# EAGLE design e_sensor (EAGLE 9.6.2)
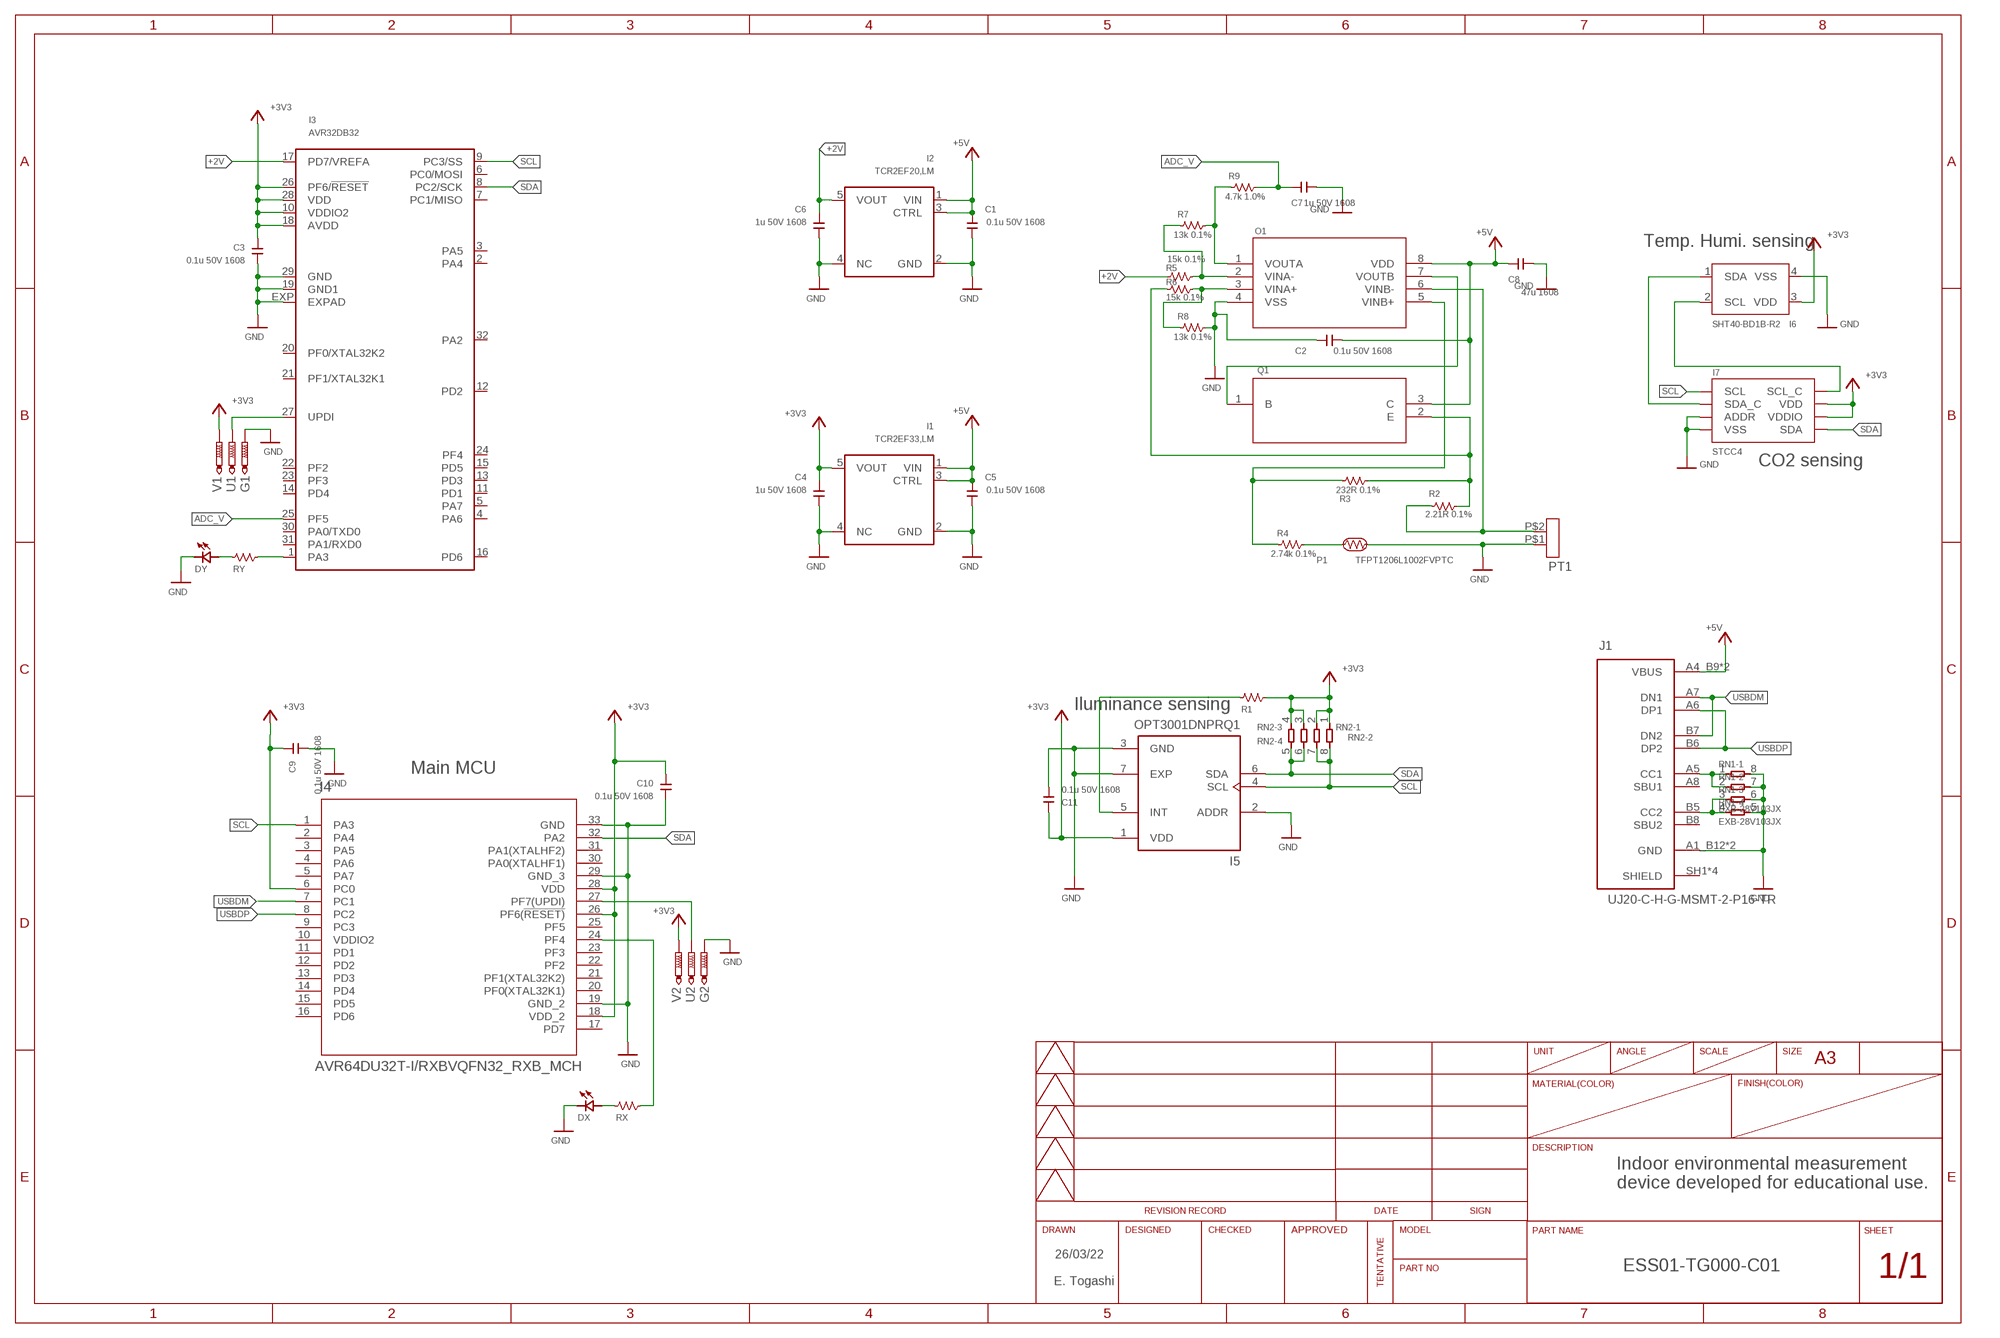
[diagram p0: schematic, sheet 1]

## Parts
C1  0.1u 50V 1608  CL10A105KP8NNNC  [C-1608/0603]
C2  0.1u 50V 1608  CL10A105KP8NNNC  [C-1608/0603]
C3  0.1u 50V 1608  CL10A105KP8NNNC  [C-1608/0603]
C4  1u 50V 1608  CL10A105KP8NNNC  [C-1608/0603]
C5  0.1u 50V 1608  CL10A105KP8NNNC  [C-1608/0603]
C6  1u 50V 1608  CL10A105KP8NNNC  [C-1608/0603]
C7  1u 50V 1608  CL10A105KP8NNNC  [C-1608/0603]
C8  47u 1608  CL10A105KP8NNNC  [C-1608/0603]
C9  0.1u 50V 1608  CL10A105KP8NNNC  [C-1608/0603]
C10  0.1u 50V 1608  CL10A105KP8NNNC  [C-1608/0603]
C11  0.1u 50V 1608  CL10A105KP8NNNC  [C-1608/0603]
DX  SML-D12D1WT86  [SMD-1608]
DY  SML-D12D1WT86  [SMD-1608]
G1  PTR1B1,27  [B1,27]
G2  PTR1B1,27  [B1,27]
I1  TCR2EF33,LM  TCR2EF20,LM  [SOT23-5L]
I2  TCR2EF20,LM  [SOT23-5L]
I3  AVR32DB32  [HVQFN32]
I4  AVR64DU32T-I/RXBVQFN32_RXB_MCH  [VQFN32_RXB_MCH]
I5  OPT3001DNPRQ1  [SON65P200X200X65-7N]
I6  SHT40-BD1B-R2  SHT41  [SHT41]
I7  STCC4  [STCC4]
J1  UJ20-C-H-G-MSMT-2-P16-TR  [SAMESKY_UJ20-C-H-G-MSMT-2-P16-TR]
O1  MCP6V02T-E/MDDFN8_4X4MC_MCH  [DFN8_4X4MC_MCH]
P1  TFPT1206L1002FVPTC  [C1206]
PT1  VELHOLE  [VELHOLE]
Q1  MMBT3904-7-FSOT-23_1_DIO  [SOT-23_1_DIO]
R1  510R 1608  R-1608  [R-1608/0603]
R2  2.21R 0.1%  R-1608  [R-1608/0603]
R3  232R 0.1%  R-1608  [R-1608/0603]
R4  2.74k 0.1%  R-1608  [R-1608/0603]
R5  15k 0.1%  R-1608  [R-1608/0603]
R6  15k 0.1%  R-1608  [R-1608/0603]
R7  13k 0.1%  R-1608  [R-1608/0603]
R8  13k 0.1%  R-1608  [R-1608/0603]
R9  4.7k 1.0%  R-1608  [R-1608/0603]
RN1  EXB-28V103JX  [RESCAXS50P200X100X45-8N]
RN2  EXB-28V103JX  [RESCAXS50P200X100X45-8N]
RX  510R 1608  R-1608  [R-1608/0603]
RY  510R 1608  R-1608  [R-1608/0603]
U1  PTR1B1,27  [B1,27]
U2  PTR1B1,27  [B1,27]
V1  PTR1B1,27  [B1,27]
V2  PTR1B1,27  [B1,27]

## Nets
+2V [PWR]: C6.P$1 I2.5(VOUT) I3.17(PD7/VREFA) R5.1
+3V3: C3.P$1 C4.P$1 C9.P$1 C10.P$1 C11.P$1 I1.5(VOUT) I3.10(VDDIO2) I3.18(AVDD) I3.26(PF6/!RESET) I3.28(VDD) I4.6(PC0) I4.18(VDD_2) I4.26(PF6(!RESET)) I4.28(VDD) I5.1(VDD) I6.3(VDD) I7.VDD I7.VDDIO R1.2 RN2.1 RN2.2 RN2.3 RN2.4 V1.TP V2.TP
+5V: C1.P$1 C2.P$1 C5.P$1 C8.P$1 I1.1(VIN) I1.3(CTRL) I2.1(VIN) I2.3(CTRL) J1.A4_B9(VBUS) J1.B4_A9(VBUS) O1.8(VDD) Q1.3(C)
ADC_V: C7.P$1 I3.25(PF5) R9.2
GND: C1.P$2 C2.P$2 C3.P$2 C4.P$2 C5.P$2 C6.P$2 C7.P$2 C8.P$2 C9.P$2 C10.P$2 C11.P$2 DX.2(C) DY.2(C) G1.TP G2.TP I1.2(GND) I1.4(NC) I2.2(GND) I2.4(NC) I3.19(GND1) I3.29(GND) I3.EXP(EXPAD) I4.19(GND_2) I4.29(GND_3) I4.33(GND) I5.2(ADDR) I5.3(GND) I5.7(EXP) I6.4(VSS) I7.ADDR I7.VSS J1.A1_B12(GND) J1.B1_A12(GND) O1.4(VSS) P1.1 PT1.P$1 R8.2 RN1.5 RN1.6 RN1.7 RN1.8
N$1: I4.24(PF4) RX.2
N$2: DY.1(A) RY.1
N$3: O1.1(VOUTA) R7.2 R9.1
N$4: DX.1(A) RX.1
N$5: O1.5(VINB+) R3.1 R4.1
N$6: I3.1(PA3) RY.2
N$7: J1.A5(CC1) RN1.1 RN1.2
N$8: J1.B5(CC2) RN1.3 RN1.4
N$9: I5.5(INT) R1.1
N$38: Q1.2(E) R2.2 R3.2 R6.1
N$42: O1.7(VOUTB) Q1.1(B)
N$44: O1.3(VINA+) R6.2 R8.1
N$46: O1.2(VINA-) R5.2 R7.1
PT1: O1.6(VINB-) PT1.P$2 R2.1
PTC1: P1.2 R4.2
SCL: I3.9(PC3/SS) I4.1(PA3) I5.4(SCL) I7.SCL RN2.7 RN2.8
SCL_C: I6.2(SCL) I7.SCL_C
SDA: I3.8(PC2/SCK) I4.32(PA2) I5.6(SDA) I7.SDA RN2.5 RN2.6
SDA_C: I6.1(SDA) I7.SDA_C
UPDI1: I3.27(UPDI) U1.TP
UPDI2: I4.27(PF7(UPDI)) U2.TP
USBDM: I4.7(PC1) J1.A7(DN1) J1.B7(DN2)
USBDP: I4.8(PC2) J1.A6(DP1) J1.B6(DP2)
Unconnected: I3.2(PA4) I3.3(PA5) I3.4(PA6) I3.5(PA7) I3.6(PC0/MOSI) I3.7(PC1/MISO) I3.11(PD1) I3.12(PD2) I3.13(PD3) I3.14(PD4) I3.15(PD5) I3.16(PD6) I3.20(PF0/XTAL32K2) I3.21(PF1/XTAL32K1) I3.22(PF2) I3.23(PF3) I3.24(PF4) I3.30(PA0/TXD0) I3.31(PA1/RXD0) I3.32(PA2) I4.2(PA4) I4.3(PA5) I4.4(PA6) I4.5(PA7) I4.9(PC3) I4.11(PD1) I4.12(PD2) I4.13(PD3) I4.14(PD4) I4.15(PD5) I4.16(PD6) I4.17(PD7) I4.20(PF0(XTAL32K1)) I4.21(PF1(XTAL32K2)) I4.22(PF2) I4.23(PF3) I4.25(PF5) I4.30(PA0(XTALHF1)) I4.31(PA1(XTALHF2)) J1.A8(SBU1) J1.B8(SBU2) J1.SH1(SHIELD) J1.SH2(SHIELD) J1.SH3(SHIELD) J1.SH4(SHIELD)

## Notes on the sheet
- Temp. Humi. sensing
- CO2 sensing
- Iluminance sensing
- Main MCU
- Indoor environmental measurement
  device developed for educational use.
- 26/03/22
- ESS01-TG000-C01
- E. Togashi

## Power pins joined to a net without a drawn wire
VDDIO2: I4.10(VDDIO2)

## Library data of the parts
C1-C11 = yamaguchi:CL10A105KP8NNNC
DX DY = yamaguchi:SML-D12D1WT86
G1 G2 U1 U2 V1 V2 = testpad:PTR1: TEST PIN
I1 I2 = yamaguchi:TCR2EF20,LM
I3 = yamaguchi:AVR32DB32
I4 = AVR64DU32T-I-RXB:AVR64DU32T-I/RXB; COPYRIGHT: Copyright (C) 2025 Ultra Librarian. All rights reserved.; MANUFACTURER_NAME: Microchip; MANUFACTURER_PART_NUMBER: AVR64DU32T-I/RXB; TYPE: Embedded
I5 = OPT3001DNPRQ1:OPT3001DNPRQ1; A_MAX: 0.65; B_MAX: 0.3; B_MIN: 0.2; B_NOM: 0.25; D2_NOM: 1.35; D_MAX: 2.1; D_MIN: 1.9; D_NOM: 2.0; E2_NOM: 0.65; ENOM: 0.65; E_MAX: 2.1; E_MIN: 1.9; E_NOM: 2.0; L_MAX: 0.35; L_MIN: 0.25; L_NOM: 0.3; MANUFACTURER: Texas Instruments; PARTREV: 01/2018; PIN_COUNT: 6.0; STANDARD: IPC 7351B
I6 = yamaguchi:SHT41
I7 = yamaguchi:STCC4
J1 = UJ20-C-H-G-MSMT-2-P16-TR:UJ20-C-H-G-MSMT-2-P16-TR; MANUFACTURER: Same Sky; MAXIMUM_PACKAGE_HEIGHT: 3.36mm; PARTREV: 1.0; STANDARD: Manufacturer Recommendations
O1 = MCP6V02:MCP6V02T-E/MD; COPYRIGHT: Copyright (C) 2025 Ultra Librarian. All rights reserved.; MANUFACTURER_NAME: Microchip; MANUFACTURER_PART_NUMBER: MCP6V02T-E/MD
P1 = yamaguchi:TFPT1206L1002FV
PT1 = velhole:VELHOLE
Q1 = MMBT3904:MMBT3904-7-F; COPYRIGHT: Copyright (C) 2025 Ultra Librarian. All rights reserved.; MANUFACTURER_NAME: Diodes Inc; MANUFACTURER_PART_NUMBER: MMBT3904-7-F
R1-R9 RX RY = yamaguchi:R-1608: R 1608/0603
RN1 RN2 = yamaguchi:EXB-28V103JX

## Net classes
0 default: width 0.127 mm
1 GND: width 0.127 mm
2 PWR: width 0.127 mm

## Board
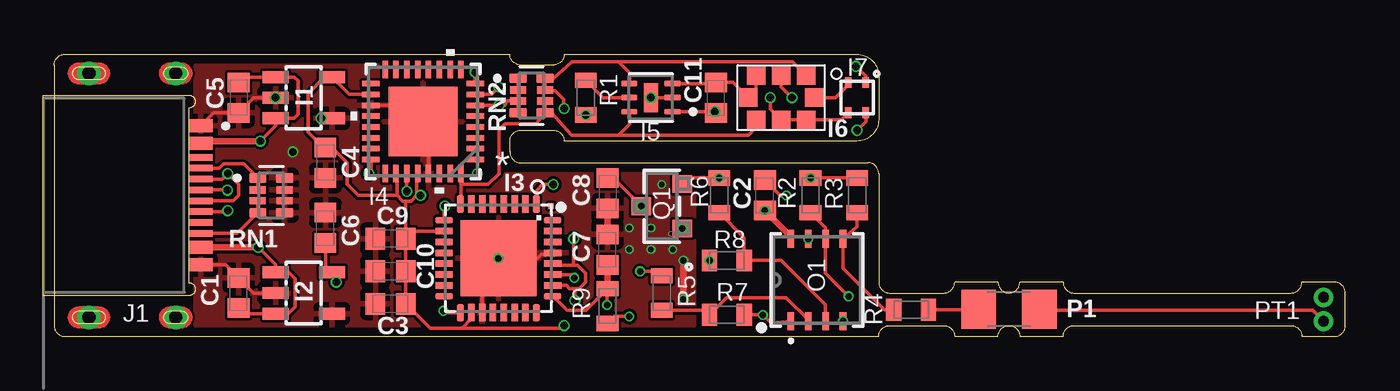
[diagram p1: board, top side]
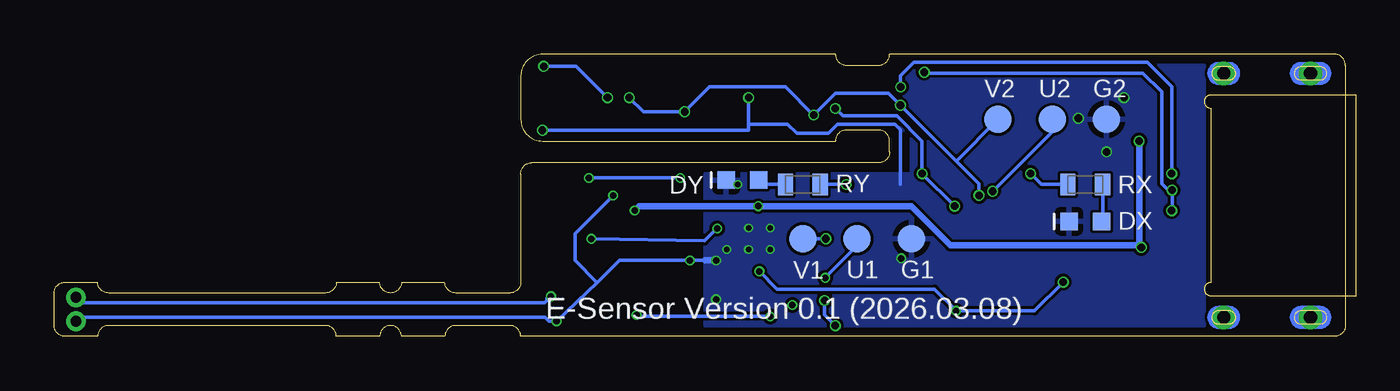
[diagram p2: board, bottom side, seen from below]

Size 59.5 x 13 mm. Coordinates in mm from the lower left corner, seen from the top.
Outline: 0,12.5 0,0.5 arc90 0.5,0 38,0 arc-90 38.5,0.5 41,0.5 arc-90 41.5,0 43.5,0 arc-90 44,0.5 arc-90 44.5,0 46.5,0 arc-90 47,0.5 57,0.5 arc-90 57.5,0 59,0 arc90 59.5,0.5 59.5,2 arc90 59,2.5 57.5,2.5 arc-90 57,2 47,2 arc-90 46.5,2.5 44.5,2.5 arc-90 44,2 arc-90 43.5,2.5 41.5,2.5 arc-90 41,2 38.5,2 arc-90 38,2.5 38,7.5 arc90 37.5,8 21.5,8 arc-90 21,8.5 21,9 arc-90 21.5,9.5 23,9.5 arc-90 23.5,9 37,9 arc90 38,10 38,12 arc90 37,13 23.5,13 arc-90 23,12.5 21.5,12.5 arc-90 21,13 0.5,13 arc90 0,12.5
Copper layers (1*16): Top 0.035mm / dielectric 1.6mm / Bottom 0.035mm
Design rules "jlcpcb-2layers *": minimum track width 5mil, minimum drill 0.3mm, track to track 5mil, track to pad 5mil, pad to pad 5mil, via to via 5mil, smd to smd 5mil, copper to edge 0.2mm, drill to drill 6mil, minimum pad ring 5mil, minimum via ring 3mil, stop-mask expansion 4mil, vias tented up to drill 20mil, thermal gap 10mil

### Footprints (pad centres in the part's own frame; a part is rotated, then mirrored left to right if it is on the bottom)
C-1608/0603 = smd 0.9 x 1: P$1 -0.7,0; P$2 0.7,0
SMD-1608 = smd 0.8 x 0.8: 1 -0.75,0; 2 0.75,0
B1,27 = smd 1.27 x 1.27: TP 0,0
SOT23-5L = smd 0.55 x 1.2: 1 -0.95,-1.3; 2 0,-1.3; 3 0.95,-1.3; 4 0.95,1.3; 5 -0.95,1.3
HVQFN32 = smd 0.8 x 0.3: 1 -2.5,1.75; 2 -2.5,1.25; 3 -2.5,0.75; 4 -2.5,0.25; 5 -2.5,-0.25; 6 -2.5,-0.75; 7 -2.5,-1.25; 8 -2.5,-1.75; 17 2.5,-1.75; 18 2.5,-1.25; 19 2.5,-0.75; 20 2.5,-0.25; 21 2.5,0.25; 22 2.5,0.75; 23 2.5,1.25; 24 2.5,1.75 | smd 0.3 x 0.8: 9 -1.75,-2.5; 10 -1.25,-2.5; 11 -0.75,-2.5; 12 -0.25,-2.5; 13 0.25,-2.5; 14 0.75,-2.5; 15 1.25,-2.5; 16 1.75,-2.5; 25 1.75,2.5; 26 1.25,2.5; 27 0.75,2.5; 28 0.25,2.5; 29 -0.25,2.5; 30 -0.75,2.5; 31 -1.25,2.5; 32 -1.75,2.5 | smd 3.5 x 3.5: EXP 0,0 | smd 0.25 x 0.25: M1 -2.415,2.415
VQFN32_RXB_MCH = smd 0.813 x 0.254: 1 -2.4,1.75; 2 -2.4,1.25; 3 -2.4,0.75; 4 -2.4,0.25; 5 -2.4,-0.25; 6 -2.4,-0.75; 7 -2.4,-1.25; 8 -2.4,-1.75; 17 2.4,-1.75; 18 2.4,-1.25; 19 2.4,-0.75; 20 2.4,-0.25; 21 2.4,0.25; 22 2.4,0.75; 23 2.4,1.25; 24 2.4,1.75 | smd 0.254 x 0.813: 9 -1.75,-2.4; 10 -1.25,-2.4; 11 -0.75,-2.4; 12 -0.25,-2.4; 13 0.25,-2.4; 14 0.75,-2.4; 15 1.25,-2.4; 16 1.75,-2.4; 25 1.75,2.4; 26 1.25,2.4; 27 0.75,2.4; 28 0.25,2.4; 29 -0.25,2.4; 30 -0.75,2.4; 31 -1.25,2.4; 32 -1.75,2.4 | smd 3.2 x 3.2: 33 0,0
SON65P200X200X65-7N = smd 0.74 x 0.27: 1 -0.995,0.65; 2 -0.995,0; 3 -0.995,-0.65; 4 0.995,-0.65; 5 0.995,0; 6 0.995,0.65 | smd 0.65 x 1.35: 7 0,0
SHT41 = smd 0.5 x 0.3: 1 -0.7,0.4; 2 -0.7,-0.4; 3 0.7,-0.4; 4 0.7,0.4
STCC4 = smd 0.85 x 0.85: ADDR -1.025,-1.15; SCL -1.025,1.15; SCL_C 0,1.525; SDA 1.025,-1.15; SDA_C -1.025,0; VDD 1.025,1.15; VDDIO 1.025,0; VSS 0,-1.525
SAMESKY_UJ20-C-H-G-MSMT-2-P16-TR = smd 0.6 x 1.1: A1_B12 -3.2,7.25; A4_B9 -2.4,7.25; B1_A12 3.2,7.25; B4_A9 2.4,7.25 | smd 0.3 x 1.1: A5 -1.25,7.25; A6 -0.25,7.25; A7 0.25,7.25; A8 1.25,7.25; B5 1.75,7.25; B6 0.75,7.25; B7 -0.75,7.25; B8 -1.75,7.25 | drill 0.6 pad 1: SH1 -5.62,6.1; SH2 5.62,6.1; SH3 -5.62,2.1; SH4 5.62,2.1
DFN8_4X4MC_MCH = smd 0.813 x 0.305: 1 -1.898,1.2; 2 -1.898,0.4; 3 -1.898,-0.4; 4 -1.898,-1.2; 5 1.898,-1.2; 6 1.898,-0.4; 7 1.898,0.4; 8 1.898,1.2
C1206 = smd 1.6 x 1.8: 1 -1.4,0; 2 1.4,0
VELHOLE = drill 0.5 pad 0.8: P$1 -0.55,0; P$2 0.55,0
SOT-23_1_DIO = smd 0.813 x 0.889: 1 -1.025,-0.945; 2 1.025,-0.945; 3 0,0.945
R-1608/0603 = smd 0.7 x 1: 1 -0.8,0; 2 0.8,0
RESCAXS50P200X100X45-8N = smd 0.79 x 0.44: 1 -0.62,0.8; 4 -0.62,-0.8; 5 0.62,-0.8; 8 0.62,0.8 | smd 0.79 x 0.34: 2 -0.62,0.25; 3 -0.62,-0.25; 6 0.62,-0.25; 7 0.62,0.25

### Placement (x,y rotation side)
C1  8.5,2 90 top
C2  32.75,6.5 90 top
C3  15.5,1.5 180 top
C4  12.5,8 270 top
C5  8.5,11 270 top
C6  12.5,5 90 top
C7  25.5,4 90 top
C8  25.5,6.6 270 top
C9  15.5,4.5 180 top
C10  15.5,3 180 top
C11  30.5,11 90 top
DX  11.98,5.3 180 bottom
DY  27.78,7.2 180 bottom
G1  20,4.5 0 bottom
G2  11,10 0 bottom
I1  11.5,11 270 top
I2  11.5,2 270 top
I3  20.47,3.6 270 top
I4  17,9.9 180 top
I5  27.5,11 180 top
I6  37,11 270 top
I7  33.5,11 270 top
J1  -0.5,6.5 270 top
O1  35.15,2.6 90 top
P1  44,1.25 180 top
PT1  58.5,1.25 90 top
Q1  28,6 90 top
R1  24.5,11 270 top
R2  34.86,6.5 90 top
R3  37,6.5 90 top
R4  39.49,1.23 0 top
R5  28,2 270 top
R6  30.65,6.5 270 top
R7  31,1 0 top
R8  31,3.5 180 top
R9  25.5,1.4 90 top
RN1  10,6.5 0 top
RN2  22,11.1 0 top
RX  11.98,7 180 bottom
RY  25,7 0 bottom
U1  22.5,4.5 0 bottom
U2  13.5,10 0 bottom
V1  25,4.5 0 bottom
V2  16,10 0 bottom

### Tracks (layer width: path | path; a pad name or v marks a point on that pad's centre or on a via)
+2V  (via drill 0.3, 0.35)
  Top 0.152: v17.93,1.18 17.93,1.1 I3.17 | v27,3 27.8,3 R5.1 | C6.P$1 12.5,3.25 I2.5 13,2.75 v13,2.5
  Bottom 0.152: v27,3 26.18,2.18 18.93,2.18 v17.93,1.18 14.32,1.18 v13,2.5
+3V3  (via drill 0.35)
  Top 0.152: I3.26 23.6,2.35 23.76,2.19 24,2.19 | I3.28 23.04,3.28 23.94,3.28 | 23.94,3.28 24.11,3.28 24.48,2.91 24.48,2.49 24.18,2.19 24,2.19 | I6.3 36.27,9.97 I7.VDD I7.VDDIO 33,10.47 v33,11 | I5.1 v30.45,10.35 C11.P$1 | RN2.1 RN2.2 RN2.3 | RN2.3 RN2.4 | I4.6 v20.5,10.65 20.78,10.65 20.88,10.85 RN2.3 | I4.18 13.6,11.15 I1.5 12.45,11.95 11.69,11.19 11.69,9.41 12.4,8.7 C4.P$1 12.7,8.5 13,8.5 13.5,8 13.5,7 14,6.5 15.8,6.5 | C9.P$1 C10.P$1 C3.P$1 17.31,0.39 18.8,0.39 | C9.P$1 16.55,4.85 I3.10 | I3.18 19.22,0.81 18.8,0.39 | 16.7,6.5 16.44,6.24 16.19,6.24 | 16.19,6.24 16.06,6.24 15.8,6.5 | I4.28 16.7,7.45 16.7,6.5 | I4.26 15.8,7.45 15.8,6.5 | C9.P$1 16.2,6.23 16.19,6.24 | 16.7,6.5 v16.88,6.5 | 23.94,3.28 v23.94,4.5 | 18.8,0.39 23.39,0.39 v23.5,0.5 | v24,1.65 24,2.19
  Bottom 0.152: v16.88,6.5 16.88,7.03 17.93,8.07 | 17.93,8.07 v20.5,10.65 21.05,11.2 23.5,11.2 R1.2 25.8,11.5 29.3,11.5 v30.45,10.35 32.35,10.35 v33,11 | v23.94,4.5 V1.TP | V2.TP 17.93,8.07 | v23.5,0.5 24,1 v24,1.65
  other vias: 24.5,10.2
+5V  (via drill 0.3, 0.35)
  Top 0.152: 33.95,4.6 O1.8 | C5.P$1 8.75,11.95 I1.1 11.05,11.95 11.23,11.77 11.23,10.23 11.05,10.05 I1.3 10.2,9.7 v9.5,9 | J1.A4_B9 6.85,9 | C1.P$1 8.75,1.05 I2.3 10.78,1.05 11.1,1.37 11.1,2.66 10.81,2.95 I2.1 10.2,3.3 v9.4,4.1 | 25.75,7.3 Q1.3
  Top 0.305: C2.P$1 33.95,4.6 | C8.P$1 25.75,7.3 | 6.85,9 v9.5,9 | J1.B4_A9 v9.4,4.1
  Bottom 0.305: C2.P$1 32.55,6 Q1.3 20,6 18.2,4.2 9.5,4.2 | v9.5,9 9.5,4.2 | 9.5,4.2 v9.4,4.1
  other vias: 27.05,6 32.75,5.8
ADC_V  (via drill 0.3)
  Top 0.152: v25.48,1.45 25.48,2.18 R9.2 24.5,1.2 23.63,1.2 23.1,1.73 23.09,1.73 I3.25
  Top 0.305: C7.P$1 R9.2
GND  (via drill 0.25, 0.3, 0.35)
  Top 0.152: C2.P$2 33.46,6.49 v33.74,6.49 | I3.19 19.72,2.85 I3.EXP 22.27,3.6 22.45,3.78 22.9,3.78 I3.29 | PT1.P$1 58,1.2 45.45,1.2 P1.1 | I5.7 I5.2 I5.3 30.45,11.65 C11.P$2 31.27,11.7 I7.VSS 32.35,11.38 I7.ADDR | I6.4 37.4,9.9 v37,9.5 | J1.A1_B12 7.35,10.3 C5.P$2 9.2,11 I1.2 | J1.B1_A12 7.9,3.3 C1.P$2 9.2,2 I2.2 | I4.19 16.25,10.65 I4.33 17.25,9.65 I4.29 | I1.4 v12.3,10.05
  Top 0.305: v29,3.5 v29,1.71 | C8.P$2 C7.P$2
  Bottom 0.152: 29.5,3.5 R8.2 33.45,3.5 34.48,2.48 | 34.48,2.48 O1.4 36.7,0.7 36.88,0.88 58.32,0.88 PT1.P$1 | v33.74,6.49 35.5,4.73 35.5,3.5 34.48,2.48 | v37,9.5 27.5,9.5 27.5,9.78 | 27.5,9.78 25.7,9.78 25.27,9.35 23.83,9.35 23.4,9.78 20.75,9.78 20.5,9.53 20.5,7 | I5.7 27.5,9.78
  Bottom 0.305: 29.5,3.5 v29,3.5
  other vias: 30.2,3.5 36.35,0.7 20.47,3.6 28,7 27.5,5 26.5,5 26.5,4 27.5,4 28.5,4 27.5,11 10.2,11 11,8.5
  pour Bottom: 6.5,12.5 20.5,12.5 20.5,9.5 20,9.5 20,7.5 29.5,7.5 29.5,0.5 6.5,0.5
  pour Top: 6.5,12.5 20.5,12.5 20.5,9.5 20,9.5 20,7.5 29.5,7.5 29.5,0.5 6.5,0.5
N$1  (via drill 0.35)
  Top 0.152: I4.24 14.6,7.6 v14.5,7.5
  Bottom 0.152: v14.5,7.5 14,7 RX.2
N$2
  Bottom 0.152: DY.1 26.83,7 RY.1
N$3  (via drill 0.3)
  Top 0.152: v26.5,0.92 25.82,0.92 R9.1 | R7.2 v32.66,0.99 33.05,0.6 O1.1
  Bottom 0.152: v26.5,0.92 32.59,0.92 v32.66,0.99
N$4
  Bottom 0.152: RX.1 11.18,5.35 DX.1
N$5
  Top 0.152: R3.1 37,5.05 O1.5 36.35,3.15 38.27,1.23 R4.1
N$6  (via drill 0.35)
  Top 0.152: I3.1 22.22,6.72 22.5,7 v23,7
  Bottom 0.152: v23,7 RY.2
N$7
  Top 0.152: J1.A5 7.61,7.75 7.81,7.95 8.73,7.95 RN1.1 RN1.2
N$8
  Top 0.152: J1.B5 8.43,4.75 RN1.4 RN1.3
N$9
  Top 0.152: I5.5 25.3,11 R1.1
N$38  (via drill 0.3)
  Top 0.152: Q1.2 29.22,7.3 R6.1 | R3.2 R2.2
  Bottom 0.152: R2.2 R6.1
  other vias: 34.86,7.3 30.65,7.3
N$42  (via drill 0.3)
  Bottom 0.152: Q1.1 29.52,4.4 O1.7
  other vias: 28.95,4.97 34.75,4.5
N$44
  Top 0.152: R6.2 31.8,4.55 R8.1 33.5,3.5 35.55,1.45 O1.3
N$46
  Top 0.152: R5.2 30,1.2 R7.1 30.99,1.79 33.72,1.79 34.75,0.76 O1.2
PT1  (via drill 0.3)
  Top 0.152: R2.1 35.55,5 O1.6 35.55,2.91 v36.61,1.85
  Bottom 0.152: PT1.P$2 58.25,1.55 36.91,1.55 36.71,1.75
  Bottom 0.305: 36.71,1.75 v36.61,1.85
PTC1
  Top 0.152: R4.2 42.58,1.23 P1.2
SCL  (via drill 0.35)
  Top 0.152: I7.SCL 34.02,12.65 26,12.65 | 26,12.65 23.86,12.65 23.01,11.9 RN2.8 RN2.7 22.64,11.32 23.07,11.32 23.48,10.92 23.48,10.52 v23.5,10.5 | I5.4 26.5,12.15 26,12.65 | I4.1 19.5,8.05 v19.5,7.5 | v18,6 17.97,5.97 I3.9
  Bottom 0.152: v18,6 v19.5,7.5 19.5,9 20.66,10.16 23.16,10.16 v23.5,10.5
SCL_C
  Top 0.152: I7.SCL_C 36,11 36.6,11.6 I6.2
SDA
  Top 0.152: RN2.6 RN2.5 | I4.32 18.75,7 | 18.75,7 18.75,6.13 I3.8 | RN2.5 22.91,10.3 23.84,9.28 26,9.28 | 26,9.28 32,9.28 32.35,9.63 I7.SDA | I5.6 26.5,9.78 26,9.28 | RN2.5 22.2,9.79 20.77,9.79 20.5,9.52 20.5,7.5 20,7 18.75,7
SDA_C  (via drill 0.35)
  Top 0.152: v36.94,12.44 37.4,11.98 I6.1 | I7.SDA_C 33.5,11.5 v34,11
  Bottom 0.152: v34,11 35.44,12.44 v36.94,12.44
UPDI1  (via drill 0.3)
  Top 0.152: v23.97,2.7 23.82,2.85 I3.27
  Bottom 0.152: v23.97,2.7 22.5,4.17 U1.TP
UPDI2  (via drill 0.35)
  Top 0.152: I4.27 v16.25,6.69
  Bottom 0.152: v16.25,6.69 13.5,9.44 U2.TP
USBDM  (via drill 0.35)
  Top 0.152: J1.B7 7.75,7.25 v8,7.5 8.5,7 8.5,6.5 8.25,6.25 J1.A7 | I4.7 20.15,11.15 v20.49,11.49
  Bottom 0.152: v20.49,11.49 20.49,12.01 19.88,12.62 9.12,12.62 8,11.5 v8,7.5
USBDP  (via drill 0.35)
  Top 0.152: J1.A6 v7.97,6.75 v7.98,6.74 | J1.B6 7.95,5.75 v8,5.8 | I4.8 v19.4,12.17 | v19.4,12.17
  Bottom 0.152: v8,5.8 7.98,5.82 v7.98,6.74 8.16,6.74 8.46,7.04 8.46,11.27 9.32,12.13 19.36,12.13 v19.4,12.17

### Text on the board
bPlace: E-Sensor Version 0.1 (2026.03.08)